# EasyEDA Pro project STM32G431RBT6.epro, schematic Schematic1
Board Name: Board1; Create Date: 2026-02-03
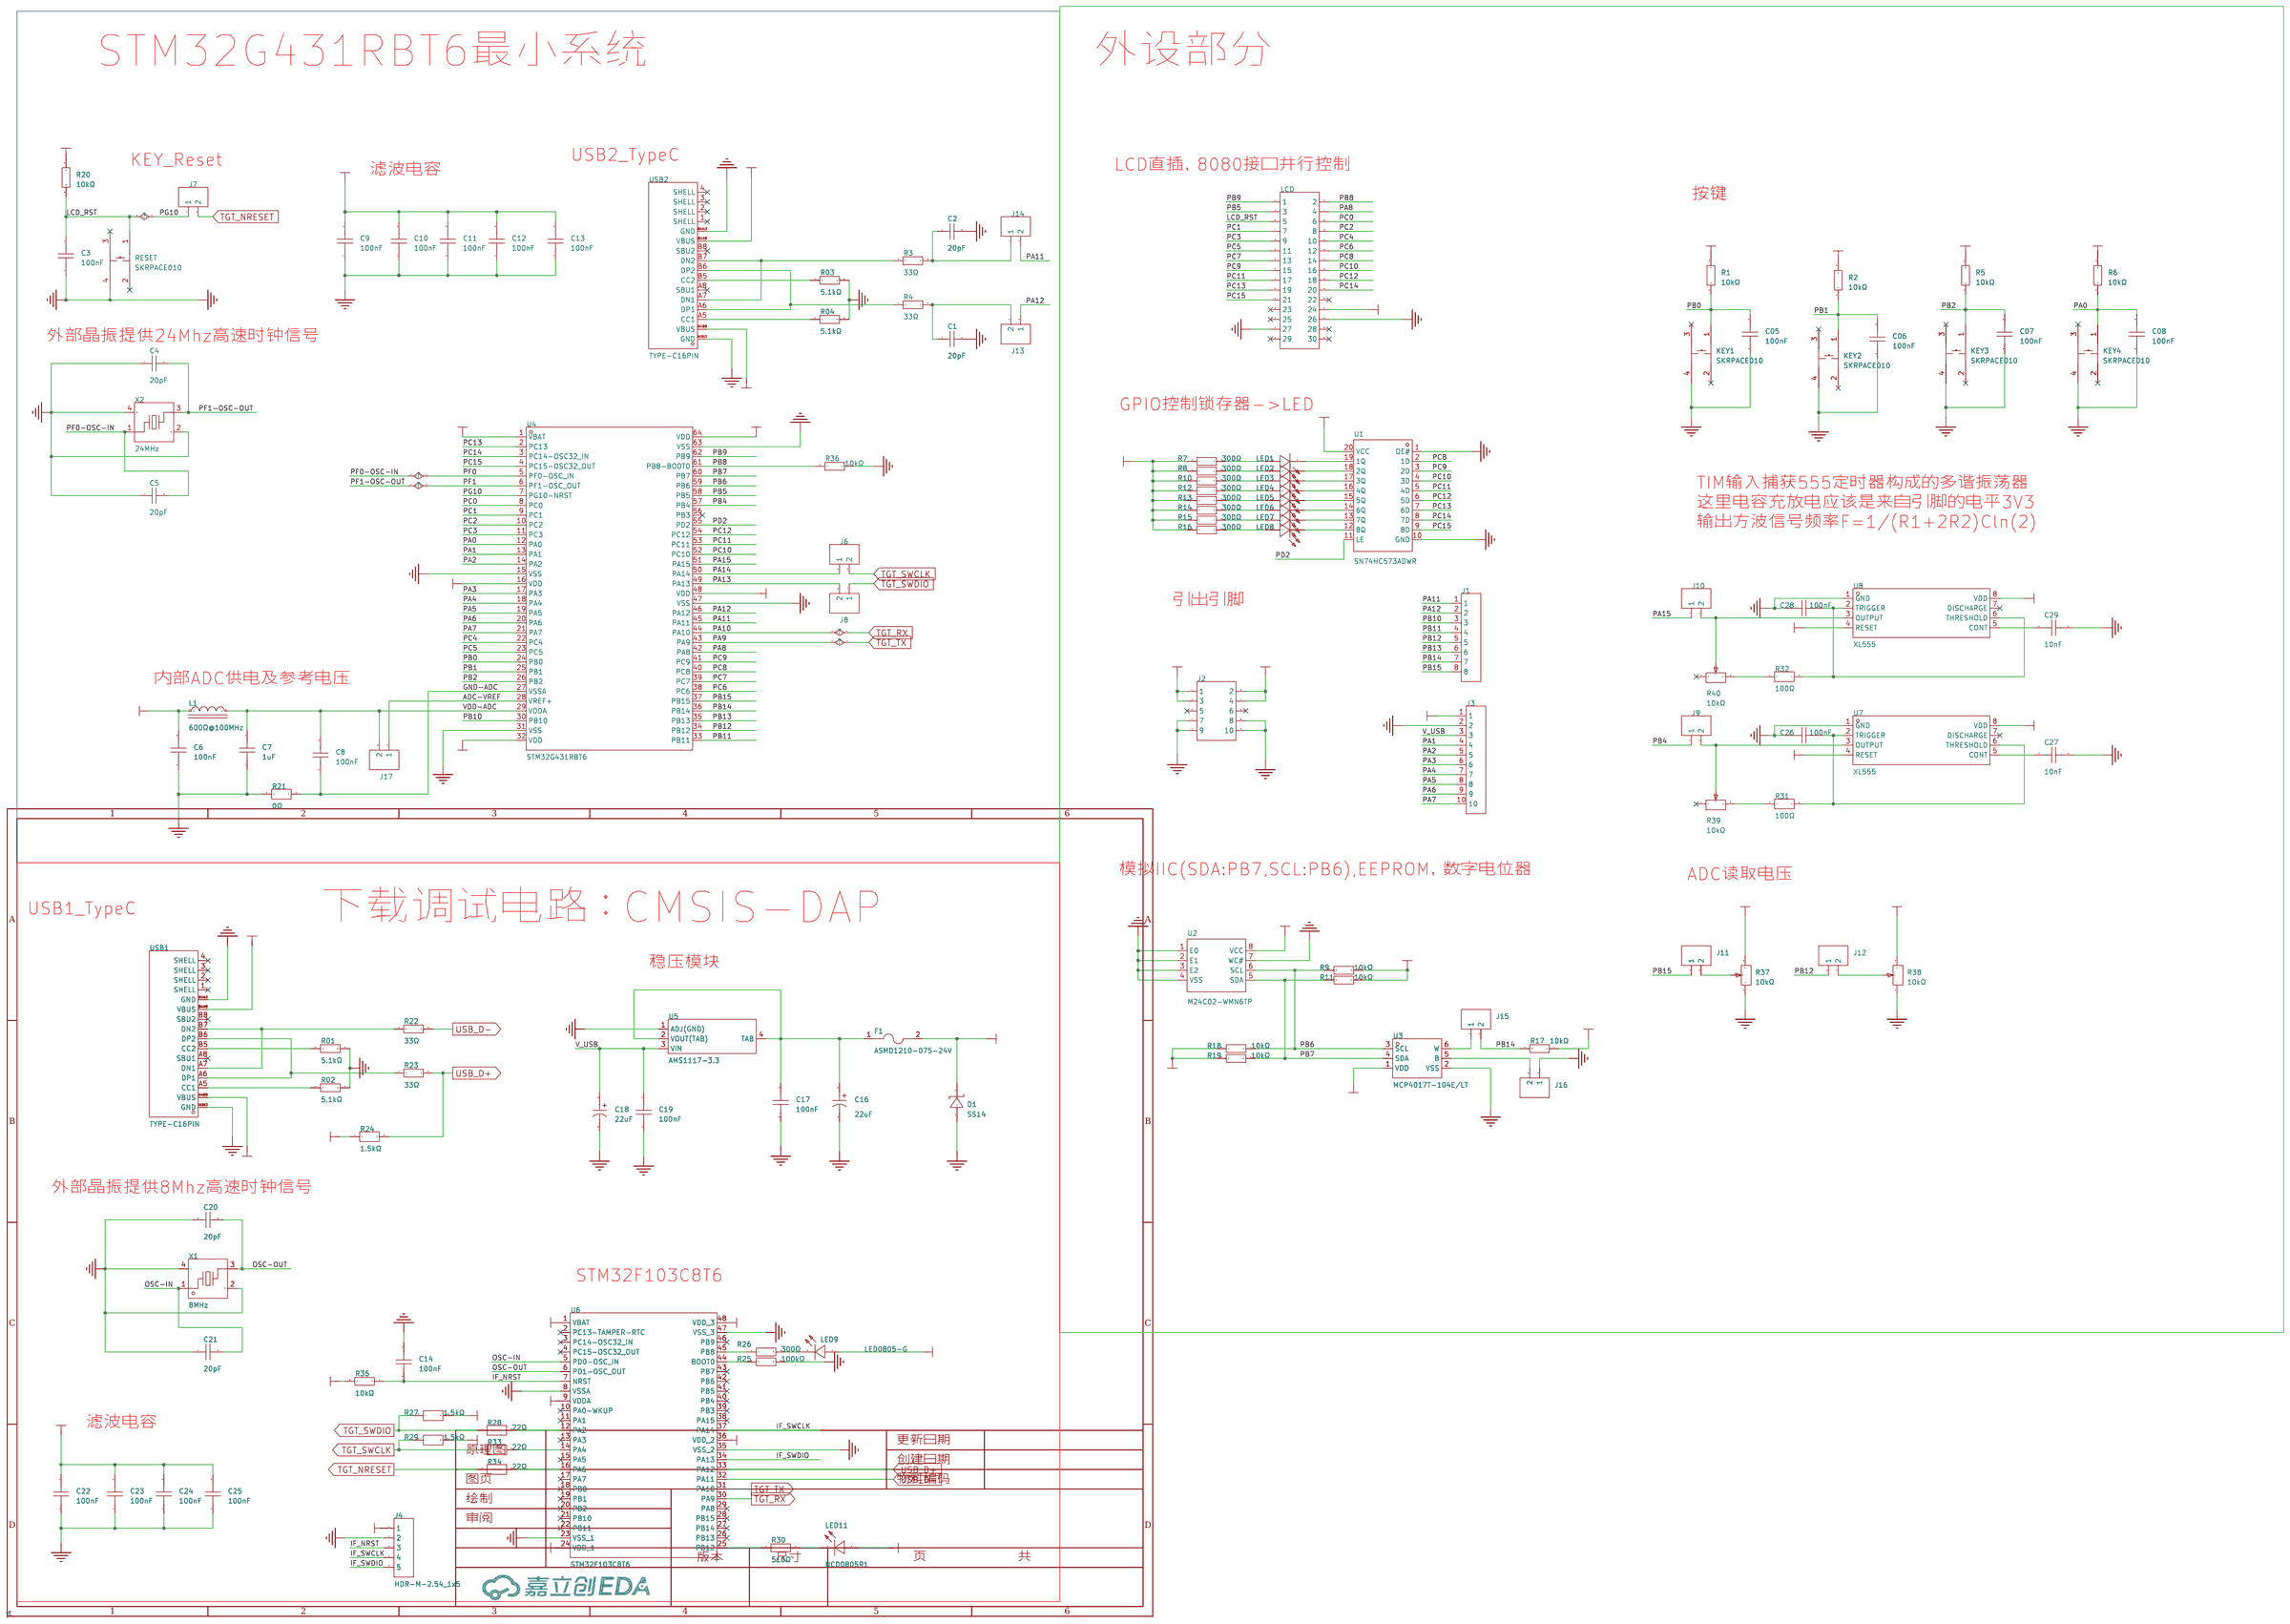
[diagram p0: schematic sheet]

## Parts
C1  20pF  [C0603]
C2  20pF  [C0603]
C3  100nF  [C0603]
C4  20pF  [C0603]
C5  20pF  [C0603]
C05  100nF  [C0603]
C6  100nF  [C0603]
C06  100nF  [C0603]
C7  1uF  [C0603]
C07  100nF  [C0603]
C8  100nF  [C0603]
C08  100nF  [C0603]
C9  100nF  [C0603]
C10  100nF  [C0603]
C11  100nF  [C0603]
C12  100nF  [C0603]
C13  100nF  [C0603]
C14  100nF  [C0603]
C16  22uF  [CAP-SMD_L3.2-W1.6]
C17  100nF  [C0603]
C18  22uF  [CAP-SMD_L3.2-W1.6]
C19  100nF  [C0603]
C20  20pF  [C0603]
C21  20pF  [C0603]
C22  100nF  [C0603]
C23  100nF  [C0603]
C24  100nF  [C0603]
C25  100nF  [C0603]
C26  100nF  [C0603]
C27  10nF  [C0603]
C28  100nF  [C0603]
C29  10nF  [C0603]
D1  SS14  [SMA_L4.2-W2.6-LS5.0-RD_1]
F1  ASMD1210-075-24V  [F1210]
J1  -  [HDR-TH_8P-P2.54-V-F-1]
J2  -  [HDR-TH_10P-P2.54-V-F-R2-C5-S2.54]
J3  -  [HDR-TH_10P-P2.54-V-F]
J4  HDR-M-2.54_1x5  [HDR-M-2.54_1X5]
J6  -  [HDR-TH_2P-P2.54-V-F]
J7  -  [HDR-TH_2P-P2.54-V-F]
J8  -  [HDR-TH_2P-P2.54-V-F]
J9  -  [HDR-TH_2P-P2.54-V-F]
J10  -  [HDR-TH_2P-P2.54-V-F]
J11  -  [HDR-TH_2P-P2.54-V-F]
J12  -  [HDR-TH_2P-P2.54-V-F]
J13  -  [HDR-TH_2P-P2.54-V-F]
J14  -  [HDR-TH_2P-P2.54-V-F]
J15  -  [HDR-TH_2P-P2.54-V-F]
J16  -  [HDR-TH_2P-P2.54-V-F]
J17  -  [HDR-TH_2P-P2.54-V-F]
KEY1  SKRPACE010  [KEY-SMD_4P-L4.2-W3.2-P2.20-LS4.6]
KEY2  SKRPACE010  [KEY-SMD_4P-L4.2-W3.2-P2.20-LS4.6]
KEY3  SKRPACE010  [KEY-SMD_4P-L4.2-W3.2-P2.20-LS4.6]
KEY4  SKRPACE010  [KEY-SMD_4P-L4.2-W3.2-P2.20-LS4.6]
L1  600Ω@100MHz  [L0603磁珠]
LCD  -  [HDR-TH_30P-P2.54-V-F-R2-C15-S2.54]
LED1  NCD0805R1  [LED0805-RD]
LED2  NCD0805R1  [LED0805-RD]
LED3  NCD0805R1  [LED0805-RD]
LED4  NCD0805R1  [LED0805-RD]
LED5  NCD0805R1  [LED0805-RD]
LED6  NCD0805R1  [LED0805-RD]
LED7  NCD0805R1  [LED0805-RD]
LED8  NCD0805R1  [LED0805-RD]
LED9  LED0805-G  [LED0805-RD_GREEN]
LED11  NCD0805R1  [LED0805-RD]
R01  5.1kΩ  [R0603]
R1  10kΩ  [R0603]
R02  5.1kΩ  [R0603]
R2  10kΩ  [R0603]
R03  5.1kΩ  [R0603]
R3  33Ω  [R0603]
R04  5.1kΩ  [R0603]
R4  33Ω  [R0603]
R5  10kΩ  [R0603]
R6  10kΩ  [R0603]
R7  300Ω  [R0603]
R8  300Ω  [R0603]
R9  10kΩ  [R0603]
R10  300Ω  [R0603]
R11  10kΩ  [R0603]
R12  300Ω  [R0603]
R13  300Ω  [R0603]
R14  300Ω  [R0603]
R15  300Ω  [R0603]
R16  300Ω  [R0603]
R17  10kΩ  [R0603]
R18  10kΩ  [R0603]
R19  10kΩ  [R0603]
R20  10kΩ  [R0603]
R21  0Ω  [R0603]
R22  33Ω  [R0603]
R23  33Ω  [R0603]
R24  1.5kΩ  [R0603]
R25  100kΩ  [R0603]
R26  300Ω  [R0603]
R27  1.5kΩ  [R0603]
R28  22Ω  [R0603]
R29  1.5kΩ  [R0603]
R30  510Ω  [R0603]
R31  100Ω  [R0603]
R32  100Ω  [R0603]
R33  22Ω  [R0603]
R34  22Ω  [R0603]
R35  10kΩ  [R0603]
R36  10kΩ  [R0603]
R37  10kΩ  [RES-ADJ-TH_3P-L9.5-W9.5-P2.50-L_3386P]
R38  10kΩ  [RES-ADJ-TH_3P-L9.5-W9.5-P2.50-L_3386P]
R39  10kΩ  [RES-ADJ-TH_3P-L9.5-W9.5-P2.50-L_3386P]
R40  10kΩ  [RES-ADJ-TH_3P-L9.5-W9.5-P2.50-L_3386P]
RESET  SKRPACE010  [KEY-SMD_4P-L4.2-W3.2-P2.20-LS4.6]
U1  SN74HC573ADWR  [SOIC-20_L13.0-W7.6-P1.27-LS10.3-BL]
U2  M24C02-WMN6TP  [SOIC-8_L4.9-W3.9-P1.27-LS6.0-BL]
U3  MCP4017T-104E/LT  [SC-70-6_L2.2-W1.3-P0.65-LS2.1-BL]
U4  STM32G431RBT6  [LQFP-64_L10.0-W10.0-P0.50-LS12.0-BL]
U5  AMS1117-3.3  [SOT-223-4_L6.5-W3.5-P2.30-LS7.0-BR]
U6  STM32F103C8T6  [LQFP-48_L7.0-W7.0-P0.50-LS9.0-BL]
U7  XL555  [SOP-8_L5.0-W4.0-P1.27-LS6.0-BL]
U8  XL555  [SOP-8_L5.0-W4.0-P1.27-LS6.0-BL]
USB1  TYPE-C16PIN  [USB-C-SMD_TYPE-C16PIN]
USB2  TYPE-C16PIN  [USB-C-SMD_TYPE-C16PIN]
X1  8MHz  [CRYSTAL-SMD_4P-L3.2-W2.5-BL]
X2  24MHz  [CRYSTAL-SMD_4P-L3.2-W2.5-BL]

## Library data of the parts
C1 C2 C4 C5 C20 C21 = CL10C200JB8NNNC: 容值:20pF;精度:±5%;额定电压:50V;温度系数:C0G;; LCSC Part Name: 20pF ±5% 50V; Supplier Part: C1648; Manufacturer: SAMSUNG(三星); Supplier Footprint: 0603; JLCPCB Part Class: 基础库; Datasheet: https://item.szlcsc.com/datasheet/CL10C200JB8NNNC/2000.html; Supplier: LCSC; Tolerance: ±5%; Voltage Rating: 50V; Temperature Coefficient: C0G
C3 C6 C8-C14 C17 C19 C22-C26 C28 = C1608X8R1H104K080AE: 容值:100nF;精度:±10%;额定电压:50V;温度系数:X8R;; LCSC Part Name: 100nF ±10% 50V; Supplier Part: C2169779; Manufacturer: TDK; Supplier Footprint: 0603; JLCPCB Part Class: 扩展库; Datasheet: https://atta.szlcsc.com/upload/public/pdf/source/20191108/C445712_D1F852F93ABDD3ED8B3146A3596EBE59.pdf; Supplier: LCSC; Tolerance: ±10%; Voltage Rating: 50V; Temperature Coefficient: X8R
C05 C06 C07 C08 = CGA0603X7R104K500JT: 容值:100nF;精度:±10%;额定电压:50V;温度系数:X7R;; LCSC Part Name: 100nF ±10% 50V; Supplier Part: C6119867; Manufacturer: HRE(芯声); Supplier Footprint: 0603; JLCPCB Part Class: 扩展库; Datasheet: https://atta.szlcsc.com/upload/public/pdf/source/20250103/C44077DA9E7B3EFAE02F22B6D3D1CBC9.pdf; Supplier: LCSC; Tolerance: ±10%; Voltage Rating: 50V; Temperature Coefficient: X7R
C7 = CL10A105KB8NNNC: 容值:1uF;精度:±10%;额定电压:50V;温度系数:X5R;; LCSC Part Name: 1uF ±10% 50V; Supplier Part: C15849; Manufacturer: SAMSUNG(三星); Supplier Footprint: 0603; JLCPCB Part Class: 基础库; Datasheet: https://item.szlcsc.com/datasheet/CL10A105KB8NNNC/16531.html; Supplier: LCSC; Tolerance: ±10%; Voltage Rating: 50V; Temperature Coefficient: X5R
C16 C18 = CA45-A-10V-22uF-K_C503893: 容值:22uF;精度:±10%;额定电压:10V;等效串联电阻(ESR):3Ω@100kHz;; LCSC Part Name: 22uF ±10% 10V; Supplier Part: C503893; Manufacturer: TORCH(火炬); Manufacturer Part: CA45-A-10V-22uF-K; Supplier Footprint: CASE-A-3216-16(mm); JLCPCB Part Class: 扩展库; Datasheet: https://item.szlcsc.com/datasheet/CA45-A-10V-22uF-K/516602.html; Supplier: LCSC; Tolerance: ±10%; Voltage Rating: 10V; Equivalent Series Resistance(ESR): 3Ω@100kHz; Operating Temperature: -55℃~+125℃
C27 C29 = C1608CH1H103J080AA: 容值:10nF;精度:±5%;额定电压:50V;温度系数:-;; LCSC Part Name: 10nF ±5% 50V; Supplier Part: C5957865; Manufacturer: TDK; Supplier Footprint: 0603; Datasheet: https://atta.szlcsc.com/upload/public/pdf/source/20230606/A83975C7E70EF5AFCD4A17254ABD78F2.pdf; Supplier: LCSC; Tolerance: ±5%; Voltage Rating: 50V
D1 = SS14_C2480: 二极管配置:独立式;正向压降(Vf):550mV@1A;直流反向耐压(Vr):40V;整流电流:1A;; LCSC Part Name: 电压:40V 电流:1A; Supplier Part: C2480; Manufacturer: MDD(辰达半导体); Supplier Footprint: SMA(DO-214AC); JLCPCB Part Class: 基础库; Datasheet: https://item.szlcsc.com/datasheet/SS14/2857.html; Supplier: LCSC; Diode Configuration: 独立式; Voltage - Forward(Vf@If): 550mV@1A; Voltage - DC Reverse(Vr): 40V; Current - Rectified: 1A; Reverse Leakage Current (Ir): 300uA@40V; Operating Junction Temperature Range: -55℃~+150℃; Non-Repetitive Peak Forward Surge Current: 25A
F1 = ASMD1210-075-24V: 耐压(Vmax):24V;最大电流(Imax):-;保持电流(Ihold):-;跳闸电流(Itrip):-;; LCSC Part Name: 24V 0.75A 1210自恢复; Supplier Part: C2982273; Manufacturer: JDTfuse(集电通); Supplier Footprint: 1210; JLCPCB Part Class: 扩展库; Datasheet: https://item.szlcsc.com/datasheet/ASMD1210-075-24V/3412161.html; Supplier: LCSC; Voltage - Max: 24V; Power Dissipation: 600mW; Resistance - Initial (Ri) (Min): 70mΩ; Resistance - Post Trip (R1) (Max): 400mΩ; Operating Temperature: -40℃~+85℃; Length: 3.2mm; Width: 2.5mm
J1 = HDR-F_2.54_1x8P: Supplier Part: C27438; Supplier Footprint: 插件; JLCPCB Part Class: 扩展库
J2 = HDR-F_2.54_2x5: Supplier Part: C92270; Supplier Footprint: 插件; JLCPCB Part Class: 扩展库
J3 = HDR-F_2.54_1x10P: Supplier Part: C2684744; Supplier Footprint: 插件; JLCPCB Part Class: 扩展库
J4 = HDR-M-2.54_1x5: Supplier Part: C358687; Supplier: LCSC
J6-J17 = HDR-F_2.54_1x2P: Supplier Part: C49661; Supplier Footprint: 插件; JLCPCB Part Class: 扩展库
KEY1-KEY4 RESET = SKRPACE010: 电路结构:单刀单掷;按钮形状:椭圆形按钮;安装方式:立贴;开关长度:4.2mm;开关宽度:3.2mm;开关高度:2.5mm;触点电流:50mA;额定电压:16V;带灯:-;工作寿命:-;; LCSC Part Name: 4.2*3.2*2.5mm 立贴 轻触开关; Supplier Part: C139797; Manufacturer: ALPSALPINE(阿尔卑斯阿尔派); Supplier Footprint: SMD; JLCPCB Part Class: 扩展库; Datasheet: https://item.szlcsc.com/datasheet/SKRPACE010/151122.html; Supplier: LCSC; Circuit: 单刀单掷; Actuator Style: 椭圆形按钮; Mounting Type: 立贴; Length: 4.2mm; Width: 3.2mm; Switch Height: 2.5mm; Contact Current: 50mA; Voltage Rating: 16V
L1 = L0603磁珠: LCSC Part Name: 单路 0603磁珠 阻抗600Ω@100MHz; Manufacturer: Sunlord(顺络); Supplier Footprint: 0603; JLCPCB Part Class: Basic Part; Datasheet: https://atta.szlcsc.com/upload/public/pdf/source/20210830/355EA7C0FAC5394FC0FE3F17C770C20A.pdf; Tolerance: ±25%; DC Resistance: 450mΩ; Current Rating: 200mA; Circuits: 1
LCD = HDR-M_2.54_2x15: Supplier Part: C58377; Supplier Footprint: 插件; JLCPCB Part Class: 扩展库
LED1-LED8 LED11 = NCD0805R1: 灯头类型:-;发光颜色:红色;正向电压(VF):1.6V~2.6V;功率:65mW;正向电流:20mA;主波长:615nm~630nm;二极管配置:独立二极管;透镜颜色:无色透明透镜;色温:-;发光强度:67mcd~195mcd;发光角度:130°;载带方式:-;工作温度:-30℃~+85℃;; Supplier Part: C84256; Manufacturer: 国星光电; Supplier Footprint: 0805; JLCPCB Part Class: 基础库; Datasheet: https://atta.szlcsc.com/upload/public/pdf/source/20200820/C84256_F0A75A43B3EAD75808600A0514C76B99.pdf; Supplier: LCSC; Emitted Color: 红色; Forward Voltage (VF): 1.6V~2.6V; Power Dissipation: 65mW; Forward Current: 20mA; Dominant Wavelength: 615nm~630nm; Diode Configuration: 独立二极管; Lens Color: 无色透明透镜; Luminous Intensity: 67mcd~195mcd; Viewing Angle: 130°; Operating Temperature: -30℃~+85℃
LED9 = LED0805-G: Supplier Part: C9900066605; JLCPCB Part Class: Extended Part; Supplier: LCSC
R01 R02 R03 R04 = 0603WAF5101T5E: 电阻类型:厚膜电阻;阻值:5.1kΩ;精度:±1%;功率:100mW;工作电压:75V;温度系数:±100ppm/℃;; LCSC Part Name: 5.1kΩ ±1% 100mW 厚膜电阻; Supplier Part: C23186; Manufacturer: UNI-ROYAL(厚声); Supplier Footprint: 0603; JLCPCB Part Class: 基础库; Datasheet: https://item.szlcsc.com/datasheet/0603WAF5101T5E/23913.html; Supplier: LCSC; Type: 厚膜电阻; Tolerance: ±1%; Power(Watts): 100mW; Voltage-Supply(Max): 75V; Temperature Coefficient: ±100ppm/℃; Operating Temperature: -55℃~+155℃
R1 R2 R5 R6 R9 R11 R17-R20 R35 R36 = 0603WAF1002T5E: 电阻类型:厚膜电阻;阻值:10kΩ;精度:±1%;功率:100mW;工作电压:75V;温度系数:±100ppm/℃;; LCSC Part Name: 厚膜电阻 10kΩ ±1% 100mW; Supplier Part: C25804; Manufacturer: UNI-ROYAL(厚声); Supplier Footprint: 0603; JLCPCB Part Class: 基础库; Datasheet: https://item.szlcsc.com/datasheet/0603WAF1002T5E/26547.html; Supplier: LCSC; Type: 厚膜电阻; Tolerance: ±1%; Power(Watts): 100mW; Voltage-Supply(Max): 75V; Temperature Coefficient: ±100ppm/℃; Operating Temperature: -55℃~+155℃
R3 R4 R22 R23 = RM06FTN33R0: 电阻类型:厚膜电阻;阻值:33Ω;精度:±1%;功率:100mW;工作电压:75V;温度系数:±100ppm/℃;; LCSC Part Name: 厚膜电阻 33Ω ±1% 100mW; Supplier Part: C188015; Manufacturer: 大毅科技; Supplier Footprint: 0603; JLCPCB Part Class: 扩展库; Datasheet: https://item.szlcsc.com/datasheet/RM06FTN33R0/199421.html; Supplier: LCSC; Type: 厚膜电阻; Tolerance: ±1%; Power(Watts): 100mW; Voltage-Supply(Max): 75V; Temperature Coefficient: ±100ppm/℃; Operating Temperature: -55℃~+155℃
R7 R8 R10 R12-R16 R26 = ETCR0603F300RK9: 电阻类型:厚膜电阻;阻值:300Ω;精度:±1%;功率:100mW;最大工作电压:50V;温度系数:±100ppm/℃;; LCSC Part Name: 厚膜电阻 300Ω ±1% 100mW; Supplier Part: C365418; Manufacturer: RESI(开步睿思); Supplier Footprint: 0603; JLCPCB Part Class: 扩展库; Datasheet: https://atta.szlcsc.com/upload/public/pdf/source/20190121/C365476_1D4B5F4656D455B591196F27522394C2.pdf; Supplier: LCSC; Type: 厚膜电阻; Tolerance: ±1%; Power(Watts): 100mW; Overload Voltage (Max): 50V; Temperature Coefficient: ±100ppm/℃; Operating Temperature Range: -55℃~+125℃
R21 = 0Ω: Supplier Part: C9900083234; Supplier Footprint: 0603; JLCPCB Part Class: 扩展库; Supplier: LCSC
R24 R27 R29 = RK73H1JTTD1501D: 电阻类型:厚膜电阻;阻值:1.5kΩ;精度:±0.5%;功率:100mW;温度系数:±100ppm/℃;; LCSC Part Name: 厚膜电阻 1.5kΩ ±0.5% 100mW; Supplier Part: C880138; Manufacturer: KOA; Supplier Footprint: 0603; JLCPCB Part Class: 扩展库; Datasheet: https://item.szlcsc.com/datasheet/RK73H1JTTD1501D/942488.html; Supplier: LCSC; Type: 厚膜电阻; Tolerance: ±0.5%; Power(Watts): 100mW; Temperature Coefficient: ±100ppm/℃; Operating Temperature: -55℃~+155℃
R25 = 100k: 电阻类型:厚膜电阻;阻值:100kΩ;精度:±1%;功率:100mW;工作电压:75V;温度系数:±100ppm/℃;; LCSC Part Name: 100kΩ ±1% 100mW 厚膜电阻; Supplier Part: C25803; Manufacturer: UNI-ROYAL(厚声); Manufacturer Part: 0603WAF1003T5E; Supplier Footprint: 0603; JLCPCB Part Class: 基础库; Datasheet: https://item.szlcsc.com/datasheet/0603WAF1003T5E/26546.html; Supplier: LCSC; Type: 厚膜电阻; Tolerance: ±1%; Power(Watts): 100mW; Voltage-Supply(Max): 75V; Temperature Coefficient: ±100ppm/℃; Operating Temperature: -55℃~+155℃
R28 R33 R34 = SDR03EZPD22R0: 电阻类型:厚膜电阻;阻值:22Ω;精度:±0.5%;功率:300mW;温度系数:±100ppm/℃;; LCSC Part Name: 厚膜电阻 22Ω ±0.5% 300mW; Supplier Part: C6216069; Manufacturer: ROHM(罗姆); Supplier Footprint: 0603; JLCPCB Part Class: 扩展库; Datasheet: https://item.szlcsc.com/datasheet/SDR03EZPD22R0/7161252.html; Supplier: LCSC; Type: 厚膜电阻; Tolerance: ±0.5%; Power(Watts): 300mW; Temperature Coefficient: ±100ppm/℃; Operating Temperature: -55℃~+155℃
R30 = 510Ω: LCSC Part Name: 510Ω ±1% 100mW 厚膜电阻; Supplier Part: C23193; Manufacturer: UNI-ROYAL(厚声); Manufacturer Part: 0603WAF5100T5E; Supplier Footprint: 0603; JLCPCB Part Class: Basic Part; Datasheet: https://atta.szlcsc.com/upload/public/pdf/source/20200306/C422600_1E6D84923E4A46A82E41ADD87F860B5C.pdf; Supplier: LCSC; Type: 厚膜电阻; Tolerance: ±1%; Power(Watts): 100mW; Overload Voltage (Max): 75V; Temperature Coefficient: ±100ppm/℃; Operating Temperature Range: -55℃~+155℃
R31 R32 = AS03W4J0101T5E: 电阻类型:厚膜电阻;阻值:100Ω;精度:±5%;功率:250mW;工作电压:75V;温度系数:±100ppm/℃;; LCSC Part Name: 100Ω ±5% 250mW 厚膜电阻 抗浪涌厚膜晶片电阻器; Supplier Part: C966205; Manufacturer: UNI-ROYAL(厚声); Supplier Footprint: 0603; JLCPCB Part Class: 扩展库; Datasheet: https://atta.szlcsc.com/upload/public/pdf/source/20200723/C560412_34ABBCC623B52ADD707B94178459E29E.pdf; Supplier: LCSC; Type: 厚膜电阻; Tolerance: ±5%; Power(Watts): 250mW; Voltage-Supply(Max): 75V; Temperature Coefficient: ±100ppm/℃; Operating Temperature: -55℃~+155℃
R37-R40 = 3386P-1-103_C330455: 阻值:10kΩ;精度:±10%;功率:500mW;温度系数:±250ppm/℃;; LCSC Part Name: 10kΩ ±10%; Supplier Part: C330455; Manufacturer: BOCHEN(博晨); Manufacturer Part: 3386P-1-103; Supplier Footprint: 插件; JLCPCB Part Class: 扩展库; Datasheet: https://item.szlcsc.com/datasheet/3386P-1-103/310185.html; Supplier: LCSC; Tolerance: ±10%; Power(Watts): 500mW; Temperature Coefficient: ±250ppm/℃
U1 = SN74HC573ADWR: Supplier: LCSC; Manufacturer: TI(德州仪器); Supplier Part: C10419; JLCPCB Part Class: Extended Part
U2 = M24C02-WMN6TP: 接口类型:I2C;存储容量:2Kbit;时钟频率(fc):400kHz;; LCSC Part Name: 1Kbit和2Kbit串行I²C总线EEPROM; Supplier Part: C7562; Manufacturer: ST(意法半导体); Supplier Footprint: SOIC-8; JLCPCB Part Class: 扩展库; Datasheet: https://item.szlcsc.com/datasheet/M24C02-WMN6TP/8039.html; Supplier: LCSC; Interface: I2C; Memory Size: 2Kbit; Clock Frequency: 400kHz; Voltage - Supply: 2.5V~5.5V; Write Cycle Time(Tw): 5ms; Data Retention - TDR (Year): 200年; Write Cycle Endurance: 400万次; Operating Temperature: -40℃~+85℃
U3 = MCP4017T-104E/LT: Supplier: LCSC; Supplier Part: C510890; Manufacturer: MICROCHIP(美国微芯); JLCPCB Part Class: Extended Part
U4 = STM32G431RBT6: CPU内核:ARM-M系列;CPU最大主频:170MHz;应用领域:-;; LCSC Part Name: 带DSP和FPU的170MHz主流ARM Cortex-M4 MCU，具有128 KB Flash存储器、数学加速器和中等模拟电平集成; Supplier Part: C431633; Manufacturer: ST(意法半导体); Supplier Footprint: LQFP-64(10x10); JLCPCB Part Class: 扩展库; Datasheet: https://item.szlcsc.com/datasheet/STM32G431RBT6/428111.html; Supplier: LCSC; CPU Core: ARM-M系列; CPU Maximum Speed: 170MHz; Program Storage Size: 128KB; Number of I/O: 52; ADC (Bit): 12bit; DAC (Bit): 12bit; Voltage - Supply: 1.71V~3.6V
U5 = AMS1117-3.3_C347222: 输出类型:固定;工作电压:12V;输出电压:3.3V;输出电流:1A;电源纹波抑制比(PSRR):60dB@(120Hz);输出极性:正极;; LCSC Part Name: 3.3V 1A 12V; Supplier Part: C347222; Manufacturer: UMW(友台半导体); Supplier Footprint: SOT-223; JLCPCB Part Class: 扩展库; Datasheet: https://item.szlcsc.com/datasheet/AMS1117-3.3/323882.html; Supplier: LCSC; Output Type: 固定; Voltage - Supply: 12V; Output Voltage: 3.3V; Output Current: 1A; Power Supply Rejection Ratio (PSRR): 60dB@(120Hz); Voltage Dropout: 1.3V@(1A); standby current: 5mA; Noise: 0.003%Vout; Features: 过流保护; Operating Temperature: -40℃~+125℃; Output Configuration: 正极; Number of Outputs: 1
U6 = STM32F103C8T6: CPU内核:ARM-M3;CPU最大主频:72MHz;应用领域:-;; LCSC Part Name: 主流增强型ARM Cortex-M3 MCU，具有64 KB Flash、72 MHz CPU、电机控制、USB和CAN; Supplier Part: C8734; Manufacturer: ST(意法半导体); Supplier Footprint: LQFP-48(7x7); JLCPCB Part Class: 扩展库; Datasheet: https://item.szlcsc.com/datasheet/STM32F103C8T6/9243.html; Supplier: LCSC; CPU Core: ARM-M3; CPU Maximum Speed: 72MHz; Program Storage Size: 64KB; Program Memory Type: FLASH; Number of I/O: 37; ADC (Bit): 12bit; Voltage - Supply: 2V~3.6V
U7 U8 = XL555: 计时器/振荡器(单路) 频率：2.1MHz 工作电压：2V~15V 工作电流：360uA  2.1MHz、250μA、低功耗计时器; LCSC Part Name: XL555 -40℃~85℃; Supplier Part: C521186; Manufacturer: XINLUDA(信路达); Supplier Footprint: SOP-8; JLCPCB Part Class: Extended Part; Datasheet: https://atta.szlcsc.com/upload/public/pdf/source/20221209/C9374A4CCB9F66B44FE739BF0B6846CF.pdf; Supplier: LCSC
USB1 USB2 = TYPE-C16PIN: 连接器类型:Type-C;协议标准:USB 3.1;公母:母;安装方式:卧贴;触点数量:16P;端口数量:1;额定电流 - 电源:3A;工作温度:-40℃~+85℃;; LCSC Part Name: Type-C 母 卧贴; Supplier Part: C393939; Manufacturer: SHOU HAN(首韩); Supplier Footprint: SMD; JLCPCB Part Class: 扩展库; Datasheet: https://item.szlcsc.com/datasheet/TYPE-C16PIN/372551.html; Supplier: LCSC; Connector Type: Type-C; Protocol Standard: USB 3.1; Gender: 母; Mounting Type: 卧贴; Number of Contacts: 16P; Number of Ports: 1; Current Rating-Power: 3A; Voltage Rating: 30V; Connect-Disconnect Life: 1万次; Detection color: 黑色; Operating Temperature: -40℃~+85℃
X1 = X32258MSB4SI: 晶振类型:贴片晶振;频率:8MHz;常温频差:±10ppm;负载电容:20pF;频率稳定度:±20ppm;; LCSC Part Name: YSX321SL 8MHZ 4P 3225 20PF ±10PPM -40~85℃ (±20PPM); Supplier Part: C2682774; Manufacturer: YXC(扬兴晶振); Supplier Footprint: SMD3225-4P; JLCPCB Part Class: 扩展库; Datasheet: https://item.szlcsc.com/datasheet/X32258MSB4SI/2777871.html; Supplier: LCSC; Type: 贴片晶振; Normal temperature Frequency Tolerance: ±10ppm; Load Capacitance: 20pF; Frequency Stability: ±20ppm; Equivalent Series Resistance(ESR): 120Ω; Operating Temperature: -40℃~+85℃
X2 = XXHCCLNANF-24MHZ: 晶振类型:贴片晶振;频率:24MHz;常温频差:±20ppm;负载电容:20pF;频率稳定度:±20ppm;; LCSC Part Name: 24MHz ±20ppm 20pF; Supplier Part: C5160135; Manufacturer: TAITIEN(泰艺电子); Supplier Footprint: SMD3225-4P; JLCPCB Part Class: 扩展库; Datasheet: https://item.szlcsc.com/datasheet/XXHCCLNANF-24MHZ/5804554.html; Supplier: LCSC; Type: 贴片晶振; Normal temperature Frequency Tolerance: ±20ppm; Load Capacitance: 20pF; Frequency Stability: ±20ppm; Operating Temperature: -40℃~+85℃

## Nets
GND: C1.2 C2.2 C3.1 C4.1 C5.1 C05.1 C6.1 C06.1 C7.1 C07.1 C08.1 C9.1 C10.1 C11.1 C12.1 C13.1 C14.1 C16.2 C17.1 C18.2 C19.1 C20.1 C21.1 C22.1 C23.1 C24.1 C25.1 C26.2 C27.2 C28.2 C29.2 D1.2(A) J2.7 J2.8 J2.9 J2.10 J3.2 J4.2 J16.1 KEY1.4 KEY2.4 KEY3.4 KEY4.4 LCD.26 LCD.27 R01.2 R02.2 R03.2 R04.2 R21.1 R25.2 R36.1 R37.1 R38.1 RESET.4 U1.1(OE#) U1.10(GND) U2.1(E0) U2.2(E1) U2.3(E2) U2.4(VSS) U2.7(WC#) U3.2(VSS) U4.15(VSS) U4.31(VSS) U4.47(VSS) U4.63(VSS) U5.1(ADJ(GND)) U6.8(VSSA) U6.23(VSS_1) U6.35(VSS_2) U6.47(VSS_3) U7.1(GND) U8.1(GND) USB1.A1B12(GND) USB1.B1A12(GND) USB2.A1B12(GND) USB2.B1A12(GND) X1.2(GND) X1.4(GND) X2.2(GND) X2.4(GND)
GND-ADC: C8.1 R21.2 U4.27(VSSA)
VDD: C6.2 C9.2 C10.2 C11.2 C12.2 C13.2 C22.2 C23.2 C24.2 C25.2 D1.1(K) F1.2 J2.1 J2.2 J2.3 J2.4 J3.1 J4.1 L1.1 LCD.24 LED9.2(A) LED11.2(+) R1.2 R2.2 R5.2 R6.2 R7.1 R8.1 R9.2 R10.1 R11.2 R12.1 R13.1 R14.1 R15.1 R16.1 R17.1 R18.2 R19.2 R20.1 R24.1 R27.2 R29.2 R35.2 R37.3 R38.3 U1.20(VCC) U2.8(VCC) U3.1(VDD) U4.1(VBAT) U4.16(VDD) U4.32(VDD) U4.48(VDD) U4.64(VDD) U6.1(VBAT) U6.9(VDDA) U6.24(VDD_1) U6.36(VDD_2) U6.48(VDD_3) U7.4(RESET) U7.8(VDD) U8.4(RESET) U8.8(VDD)
VDD-ADC: C7.2 C8.2 J17.2 L1.2 U4.29(VDDA)
ADC-VREF: J17.1 U4.28(VREF+)
IF_NRST: C14.2 J4.3 R35.1 U6.7(NRST)
IF_SWCLK: J4.4 U6.37(PA14)
IF_SWDIO: J4.5 U6.34(PA13)
LCD_RST: C3.2 J7.1 LCD.5 R20.2 RESET.1 U4.7(PG10-NRST)
OSC-IN: C21.2 U6.5(PD0-OSC_IN) X1.1
OSC-OUT: C20.2 U6.6(PD1-OSC_OUT) X1.3
PA0: C08.2 KEY4.1 R6.1 U4.12(PA0)
PA1: J3.4 U4.13(PA1)
PA2: J3.5 U4.14(PA2)
PA3: J3.6 U4.17(PA3)
PA4: J3.7 U4.18(PA4)
PA5: J3.8 U4.19(PA5)
PA6: J3.9 U4.20(PA6)
PA7: J3.10 U4.21(PA7)
PA8: LCD.4 U4.42(PA8)
PA9: U4.43(PA9) U6.31(PA10)
PA10: U4.44(PA10) U6.30(PA9)
PA11: J1.1 J14.2 U4.45(PA11)
PA12: J1.2 J13.1 U4.46(PA12)
PA13: J8.2 U4.49(PA13)
PA14: J6.1 U4.50(PA14)
PA15: J10.1 U4.51(PA15)
PB0: C05.2 KEY1.1 R1.1 U4.24(PB0)
PB1: C06.2 KEY2.1 R2.1 U4.25(PB1)
PB2: C07.2 KEY3.1 R5.1 U4.26(PB2)
PB4: J9.1 U4.57(PB4)
PB5: LCD.3 U4.58(PB5)
PB6: R9.1 R18.1 U2.6(SCL) U3.3(SCL) U4.59(PB6)
PB7: R11.1 R19.1 U2.5(SDA) U3.4(SDA) U4.60(PB7)
PB8: LCD.2 R36.2 U4.61(PB8-BOOT0)
PB9: LCD.1 U4.62(PB9)
PB10: J1.3 U4.30(PB10)
PB11: J1.4 U4.33(PB11)
PB12: J1.5 J12.1 U4.34(PB12)
PB13: J1.6 U4.35(PB13)
PB14: J1.7 J15.2 R17.2 U4.36(PB14)
PB15: J1.8 J11.1 U4.37(PB15)
PC0: LCD.6 U4.8(PC0)
PC1: LCD.7 U4.9(PC1)
PC2: LCD.8 U4.10(PC2)
PC3: LCD.9 U4.11(PC3)
PC4: LCD.10 U4.22(PC4)
PC5: LCD.11 U4.23(PC5)
PC6: LCD.12 U4.38(PC6)
PC7: LCD.13 U4.39(PC7)
PC8: LCD.14 U1.2(1D) U4.40(PC8)
PC9: LCD.15 U1.3(2D) U4.41(PC9)
PC10: LCD.16 U1.4(3D) U4.52(PC10)
PC11: LCD.17 U1.5(4D) U4.53(PC11)
PC12: LCD.18 U1.6(5D) U4.54(PC12)
PC13: LCD.19 U1.7(6D) U4.2(PC13)
PC14: LCD.20 U1.8(7D) U4.3(PC14-OSC32_IN)
PC15: LCD.21 U1.9(8D) U4.4(PC15-OSC32_OUT)
PD2: U1.11(LE) U4.55(PD2)
PF0: C5.2 U4.5(PF0-OSC_IN) X2.1
PF1: C4.2 U4.6(PF1-OSC_OUT) X2.3
TGT_NRESET: J7.2 R34.1
TGT_SWCLK: J6.2 R29.1 R33.1
TGT_SWDIO: J8.1 R27.1 R28.1
USB_D+: R23.2 R24.2 U6.33(PA12)
USB_D-: R22.2 U6.32(PA11)
V_USB: C18.1 C19.2 J3.3 U5.3(VIN) USB1.A4B9(VBUS) USB1.B4A9(VBUS) USB2.A4B9(VBUS) USB2.B4A9(VBUS)
$1N293: R22.1 USB1.A7(DN1) USB1.B7(DN2)
$1N298: R02.1 USB1.A5(CC1)
$1N932: C16.1 C17.2 F1.1 U5.2(VOUT(TAB)) U5.4(TAB)
$1N1766: R23.1 USB1.A6(DP1) USB1.B6(DP2)
$1N1770: R01.1 USB1.B5(CC2)
$1N2073: LED9.1(C) R26.2
$1N2077: R26.1 U6.45(PB8)
$1N2171: R25.1 U6.44(BOOT0)
$1N2382: R30.1 U6.25(PB12)
$1N2584: LED11.1(-) R30.2
$1N3400: R28.2 U6.12(PA2)
$1N3632: R33.2 U6.14(PA4)
$1N3787: R34.2 U6.16(PA6)
$1N10750: LED1.2(+) R7.2
$1N10754: LED2.2(+) R8.2
$1N10759: LED3.2(+) R10.2
$1N10764: LED4.2(+) R12.2
$1N10769: LED5.2(+) R13.2
$1N10774: LED6.2(+) R14.2
$1N10779: LED7.2(+) R15.2
$1N10784: LED8.2(+) R16.2
$1N10789: LED1.1(-) U1.19(1Q)
$1N10794: LED2.1(-) U1.18(2Q)
$1N10799: LED3.1(-) U1.17(3Q)
$1N10804: LED4.1(-) U1.16(4Q)
$1N10809: LED5.1(-) U1.15(5Q)
$1N10814: LED6.1(-) U1.14(6Q)
$1N10822: LED7.1(-) U1.13(7Q)
$1N10827: LED8.1(-) U1.12(8Q)
$1N11521: J16.2 U3.5(B)
$1N11558: J15.1 U3.6(W)
$1N12241: J11.2 R37.2
$1N12250: J12.2 R38.2
$1N12886: C28.1 R32.2 U8.2(TRIGGER) U8.6(THRESHOLD)
$1N13012: J10.2 R40.2 U8.3(OUTPUT)
$1N13102: R32.1 R40.3
$1N13144: C29.1 U8.5(CONT)
$1N13445: C26.1 R31.2 U7.2(TRIGGER) U7.6(THRESHOLD)
$1N13461: J9.2 R39.2 U7.3(OUTPUT)
$1N13465: R31.1 R39.3
$1N13467: C27.1 U7.5(CONT)
$1N14145: R3.1 USB2.A7(DN1) USB2.B7(DN2)
$1N14150: R04.1 USB2.A5(CC1)
$1N14152: R03.1 USB2.B5(CC2)
$1N14154: R4.1 USB2.A6(DP1) USB2.B6(DP2)
$1N14165: C2.1 J14.1 R3.2
$1N14181: C1.1 J13.2 R4.2

Not connected (* = marked no-connect by the designer): J2 5* 6*; KEY1 2* 3*; KEY2 2* 3*; KEY3 2* 3*; KEY4 2* 3*; LCD 22* 23* 25* 28* 29* 30*; R39 1*; R40 1*; RESET 2* 3*; U4 56(PB3)*; U6 2(PC13-TAMPER-RTC)* 3(PC14-OSC32_IN)* 4(PC15-OSC32_OUT)* 10(PA0-WKUP)* 11(PA1)* 13(PA3)* 15(PA5)* 17(PA7)* 18(PB0)* 19(PB1)* 20(PB2)* 21(PB10)* 22(PB11)* 26(PB13)* 27(PB14)* 28(PB15)* 29(PA8)* 38(PA15)* 39(PB3)* 40(PB4)* 41(PB5)* 42(PB6)* 43(PB7)* 46(PB9)*; U7 7(DISCHARGE)*; U8 7(DISCHARGE)*; USB1 1(SHELL)* 2(SHELL)* 3(SHELL)* 4(SHELL)* A8(SBU1)* B8(SBU2)*; USB2 1(SHELL)* 2(SHELL)* 3(SHELL)* 4(SHELL)* A8(SBU1)* B8(SBU2)*

## Notes on the sheet
- STM32G431RBT6最小系统
- 外设部分
- KEY_Reset
- USB2_TypeC
- LCD直插，8080接口并行控制
- 滤波电容
- 按键
- 外部晶振提供24Mhz高速时钟信号
- GPIO控制锁存器->LED
- TIM输入捕获555定时器构成的多谐振荡器
  这里电容充放电应该是来自引脚的电平3V3
  输出方波信号频率F=1/(R1+2R2)Cln(2)
- 引出引脚
- 内部ADC供电及参考电压
- 模拟IIC(SDA:PB7,SCL:PB6),EEPROM，数字电位器
- ADC读取电压
- USB1_TypeC
- 下载调试电路：CMSIS-DAP
- 稳压模块
- 外部晶振提供8Mhz高速时钟信号
- STM32F103C8T6
- 滤波电容
